# Altium schematic sheet Bicikli.SchDoc
size A4; SheetNumber: 1; SheetTotal: 3
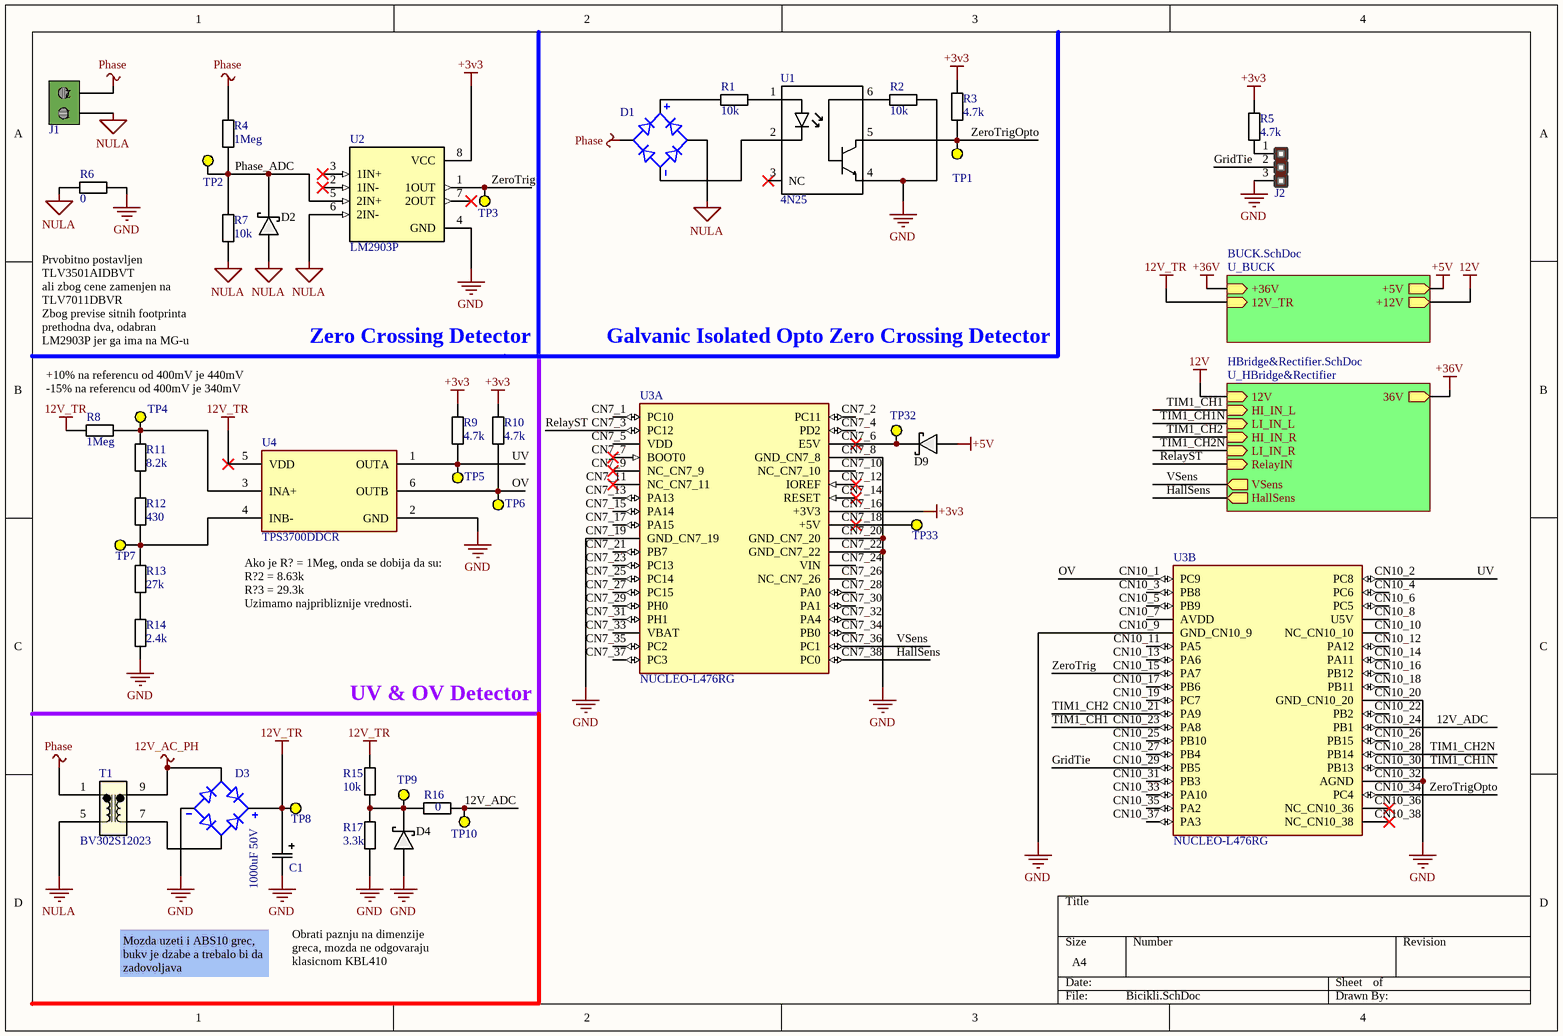
[diagram p0: Bicikli.SchDoc]

## Parts
C1  1000uF 50V  [CAP_12.5 X 25_NCH]
D1  KBP208G  [SIP350W80P400L1450H1280Q4]  (value not drawn)
D2  SCH_DIODE  [SMA]  (value not drawn)
D3  KBP208G  [SIP350W80P400L1450H1280Q4]  (value not drawn)
D4  SCH_DIODE  [SMA]  (value not drawn)
D9  SCH_DIODE  [SMA]  (value not drawn)
J1  Wire Terminal Block 2 pin 5mm  [WireTerminalPCB5mm2PIN]  (value not drawn)
J2  3Pin  [HEADER3PIN]  (value not drawn)
R1  10k  [RESISTOR_THRUHOLE_1/4W]
R2  10k  [RESISTOR_0805]
R3  4.7k  [RESISTOR_0805]
R4  1Meg  [RESISTOR_THRUHOLE_1/4W]
R5  4.7k  [RESISTOR_0805]
R6  0  [RESISTOR_1206]
R7  10k  [RESISTOR_THRUHOLE_1/4W]
R8  1Meg  [RESISTOR_0805]
R9  4.7k  [RESISTOR_0805]
R10  4.7k  [RESISTOR_0805]
R11  8.2k  [RESISTOR_0805]
R12  430  [RESISTOR_0805]
R13  27k  [RESISTOR_0805]
R14  2.4k  [RESISTOR_0805]
R15  10k  [RESISTOR_0805]
R16  0  [RESISTOR_0805]
R17  3.3k  [RESISTOR_0805]
T1  BV302S12023  [BV302S12023_ZLM]
TP1  TP  [TP]  (value not drawn)
TP2  TP  [TP]  (value not drawn)
TP3  TP  [TP]  (value not drawn)
TP4  TP  [TP]  (value not drawn)
TP5  TP  [TP]  (value not drawn)
TP6  TP  [TP]  (value not drawn)
TP7  TP  [TP]  (value not drawn)
TP8  TP  [TP]  (value not drawn)
TP9  TP  [TP]  (value not drawn)
TP10  TP  [TP]  (value not drawn)
TP32  TP  [TP]  (value not drawn)
TP33  TP  [TP]  (value not drawn)
U1  4N25  [DIP762W50P254L712H400Q6N]
U2  LM2903P  [DIP794W45P254L959H508Q8]
U3  NUCLEO-L476RG  [MODULE_NUCLEO-L476RG]  (parts A,B of 2)
U4  TPS3700DDCR  [FP-DDC0006A-IPC_A]

## Sub-sheets
U_BUCK = BUCK.SchDoc: +5V (out), +36V (in), +12V (out), 12V_TR (in)
U_HBridge&Rectifier = HBridge&Rectifier.SchDoc: HallSens (out), VSens (out), RelayIN (in), HI_IN_L (in), LI_IN_L (in), HI_IN_R (in), LI_IN_R (in), 12V (in), 36V (out)

## Nets
12V: sheet U_HBridge&Rectifier/12V, sheet U_BUCK/+12V
12V_AC_PH: D3.3(AC2) T1.9
12V_TR: C1.1 D3.1(POS) R8.2 R15.2 TP8.1 U4.5(VDD) ; sheet U_BUCK/12V_TR
+3v3: R3.2 R5.2 R9.2 R10.2 U2.8(VCC) U3.CN7_16(+3V3)
+5V: D9.1 ; sheet U_BUCK/+5V
+36V: sheet U_HBridge&Rectifier/36V, sheet U_BUCK/+36V
GND: C1.2 D3.4(NEG) D4.1 J2.3 R2.1 R6.1 R14.1 R17.1 U1.4(E) U2.4(GND) U3.CN7_8(GND_CN7_8) U3.CN7_19(GND_CN7_19) U3.CN7_20(GND_CN7_20) U3.CN7_22(GND_CN7_22) U3.CN10_9(GND_CN10_9) U3.CN10_20(GND_CN10_20) U3.CN10_32(AGND) U4.2(GND)
NULA: D1.2(AC1) D2.1 J1.1 R6.2 R7.1 T1.5 U2.6(2IN-)
Phase: D1.3(AC2) J1.2 R4.2 T1.1
12V_ADC: R16.2 TP10.1 U3.CN10_24(PB1)
GridTie: J2.2 U3.CN10_29(PB5)
HallSens: U3.CN7_38(PC0) ; sheet U_HBridge&Rectifier/HallSens
OV: R10.1 TP6.1 U3.CN10_1(PC9) U4.6(OUTB)
Phase_ADC: D2.2 R4.1 R7.2 TP2.1 U2.5(2IN+)
RelayST: U3.CN7_3(PC12) ; sheet U_HBridge&Rectifier/RelayIN
TIM1_CH1: U3.CN10_23(PA8) ; sheet U_HBridge&Rectifier/HI_IN_L
TIM1_CH1N: U3.CN10_30(PB13) ; sheet U_HBridge&Rectifier/LI_IN_L
TIM1_CH2: U3.CN10_21(PA9) ; sheet U_HBridge&Rectifier/HI_IN_R
TIM1_CH2N: U3.CN10_28(PB14) ; sheet U_HBridge&Rectifier/LI_IN_R
UV: R9.1 TP5.1 U3.CN10_2(PC8) U4.1(OUTA)
VSens: U3.CN7_36(PC1) ; sheet U_HBridge&Rectifier/VSens
ZeroTrig: TP3.1 U2.1(1OUT) U3.CN10_15(PA7)
ZeroTrigOpto: R3.1 TP1.1 U1.5(C) U3.CN10_34(PC4)
NetD1_1: D1.1(POS) R1.2
NetD1_4: D1.4(NEG) U1.2(K)
NetD3_2: D3.2(AC1) T1.7
NetD4_2: D4.2 R15.1 R16.1 R17.2 TP9.1
NetD9_2: D9.2 TP32.1 U3.CN7_6(E5V)
NetJ2_1: J2.1 R5.1
NetR1_1: R1.1 U1.1(A)
NetR2_2: R2.2 U1.6(B)
NetR8_1: R8.1 R11.2 TP4.1 U4.3(INA+)
NetR11_1: R11.1 R12.2
NetR12_1: R12.1 R13.2 TP7.1 U4.4(INB-)
NetR13_1: R13.1 R14.2
NetTP33_1: TP33.1 U3.CN7_18(+5V)

Not connected (* = marked no-connect by the designer): U1 3(NC)*; U2 2(1IN-)* 3(1IN+)* 7(2OUT)*; U3 CN7_1(PC10) CN7_2(PC11) CN7_4(PD2) CN7_5(VDD) CN7_7(BOOT0)* CN7_9(NC_CN7_9)* CN7_10(NC_CN7_10) CN7_11(NC_CN7_11)* CN7_12(IOREF)* CN7_13(PA13) CN7_14(RESET)* CN7_15(PA14) CN7_17(PA15) CN7_21(PB7) CN7_23(PC13) CN7_24(VIN) CN7_25(PC14) CN7_26(NC_CN7_26) CN7_27(PC15) CN7_28(PA0) CN7_29(PH0) CN7_30(PA1) CN7_31(PH1) CN7_32(PA4) CN7_33(VBAT) CN7_34(PB0) CN7_35(PC2) CN7_37(PC3) CN10_3(PB8) CN10_4(PC6) CN10_5(PB9) CN10_6(PC5) CN10_7(AVDD) CN10_8(U5V) CN10_10(NC_CN10_10) CN10_11(PA5) CN10_12(PA12) CN10_13(PA6) CN10_14(PA11) CN10_16(PB12) CN10_17(PB6) CN10_18(PB11) CN10_19(PC7) CN10_22(PB2) CN10_25(PB10) CN10_26(PB15) CN10_27(PB4) CN10_31(PB3) CN10_33(PA10) CN10_35(PA2) CN10_36(NC_CN10_36)* CN10_37(PA3) CN10_38(NC_CN10_38)*

## Notes on the sheet
- (near R7) Prvobitno postavljen TLV3501AIDBVT
  ali zbog cene zamenjen na TLV7011DBVR
  Zbog previse sitnih footprinta prethodna dva, odabran LM2903P jer ga ima na MG-u
- +10% na referencu od 400mV je 440mV
- Zero Crossing Detector
- Galvanic Isolated Opto Zero Crossing Detector
- -15% na referencu od 400mV je 340mV
- (near U4) Ako je R? = 1Meg, onda se dobija da su:
  R?2 = 8.63k
  R?3 = 29.3k
  Uzimamo najpribliznije vrednosti.
- UV & OV Detector
- Mozda uzeti i ABS10 grec, bukv je dzabe a trebalo bi da zadovoljava
- Obrati paznju na dimenzije greca, mozda ne odgovaraju klasicnom KBL410

## Library data of the parts
C1 = UVY1H102MHD: Manufacturer_Name: Nichicon; Copyright: Copyright (C) 2025 Ultra Librarian. All rights reserved.; Manufacturer_Part_Number: UVY1H102MHD
D1 D3 = KBP208G: Bridge Rectifier Single Phase Standard 100 V Through Hole KBP; MF: GeneSiC Semiconductor; MP: KBP202G; SnapEDA_Link: https://www.snapeda.com/parts/KBP202G/GeneSiC+Semiconductor/view-part/?ref=snap; Package: SIP-4 GeneSiC Semiconductor; Value: *; Check_prices: https://www.snapeda.com/parts/KBP202G/GeneSiC+Semiconductor/view-part/?ref=eda
J1 = Wire Terminal Block 2 pin 5mm: Wire Terminal PCB Block 2 pin 5mm
J2 = HEADER3PIN: 3 PIN Male Header 2.54mm pitch
R1 R2 R7 R15 = R000005: RES  10k OHM 1% 1/8W 0805; resistance: 10k
R3 R5 R9 R10 = R000116: RES  4k7 OHM 1% 1/8W 0805; resistance: 4.7k
R4 R8 = R000007: RES  1Meg OHM 1% 1/8W 0805; resistance: 1Meg
R6 R16 = R000000: RES  0 OHM JUMPER 1/8W 0805; resistance: 1; Supplier 1: Mouser; Supplier Part Number 1: 71-CRCW0805-1-E3; Supplier 2: Mouser; Supplier Part Number 2: 667-ERJ-6RQF1R0V; Supplier 3: Mouser; Supplier Part Number 3: 667-ERJ-6BQF1R0V
R11 = R000158: RES  8k2 OHM 1% 1/8W 0805; resistance: 8.2k
R12 = R000108: RES  430 OHM 1% 1/8W 0805; resistance: 430
R13 = R000075: RES  27k OHM 1% 1/8W 0805; resistance: 27k
R14 = R000067: RES  2k4 OHM 1% 1/8W 0805; resistance: 2.4k
R17 = R000088: RES  3k3 OHM 1% 1/8W 0805; resistance: 3.3k
T1 = BV302S12023: No Description Available; Manufacturer_Name: Zettler Magnetics; Type: Power Transformers; Copyright: Copyright (C) 2025 Ultra Librarian. All rights reserved.; Manufacturer_Part_Number: BV302S12023; RefDes: RefDes
TP1-TP10 TP32 TP33 = TP: Test Point 1.5mm radius
U1 = 4N25: Optoisolator, Analog, 6-Pin DIP, Transistor, w/Base Connection | Vishay / Small Signal & Opto Products (SSP) 4N25; MF: Vishay Semiconductor; SnapEDA_Link: https://www.snapeda.com/parts/4N25/Vishay/view-part/?ref=snap; Package: DIP-6 Everlight Electronics CO., LTD; Value: *; MP: 4N25; Check_prices: https://www.snapeda.com/parts/4N25/Vishay/view-part/?ref=eda
U2 = LM2903P: Dual differential comparator; MF: Texas Instruments; SnapEDA_Link: https://www.snapeda.com/parts/LM2903P/Texas+Instruments/view-part/?ref=snap; Package: PDIP-8 Texas; Value: *; MP: LM2903P; Check_prices: https://www.snapeda.com/parts/LM2903P/Texas+Instruments/view-part/?ref=eda
U3 = NUCLEO-L476RG: STM32L476RG, mbed-Enabled Development Nucleo-64 STM32L4 ARMÂ® CortexÂ®-M4 MCU 32-Bit Embedded Evaluation Board; MF: STMicroelectronics; SnapEDA_Link: https://www.snapeda.com/parts/NUCLEO-L476RG/STMicroelectronics/view-part/?ref=snap; Package: None; Value: *; MP: NUCLEO-L476RG; Check_prices: https://www.snapeda.com/parts/NUCLEO-L476RG/STMicroelectronics/view-part/?ref=eda
U4 = CMP-1708-00001-5: IC COMP WINDOW W/REF 6SOT; Operating Supply Current: 5.5uA; Min Supply Voltage: 1.8V; Nominal Supply Current: 7uA; Number of Voltages Monitored: 2; Max Supply Voltage: 18V; Undervoltage Threshold: 1.7V; Quiescent Current: 11uA; Watchdog Timer: No; Number of Channels: 1; Hysteresis: 5.5mV; Propagation Delay: 29us; REACH SVHC: No SVHC; Case/Package: SOT; Number of Pins: 6; Mount: Surface Mount; Radiation Hardening: No; Max Operating Temperature: 125°C; Package Quantity: 3000; Min Operating Temperature: -40°C; Packaging: Tape and Reel; Number of Elements: 2; Lead Free: Lead Free